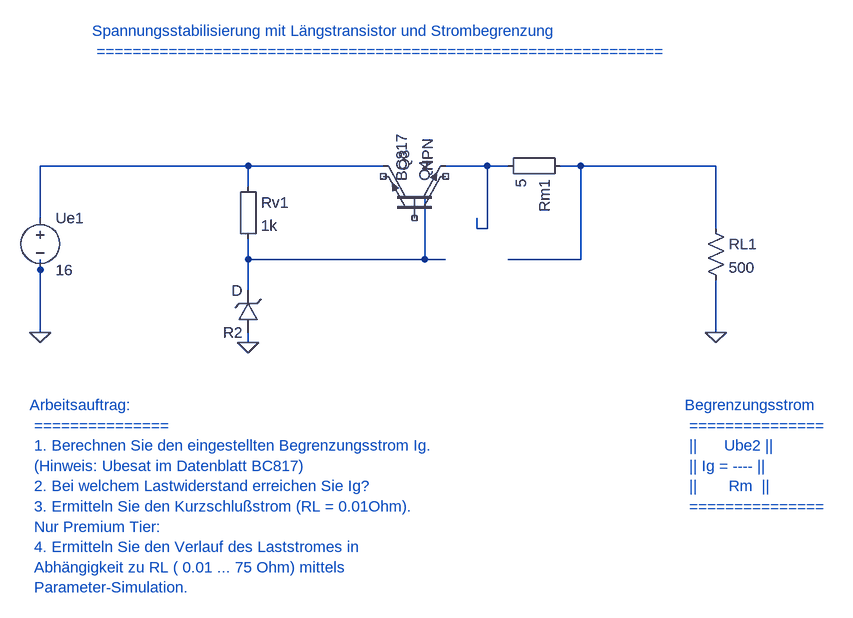
[diagram p0: schematic 5_7_5_Spannungsstabilisierung_mit_Strombegrenzung.asc]
5_7_5_Spannungsstabilisierung_mit_Strombegrenzung.asc, the LTspice schematic file:
Version 4
SHEET 1 880 680
WIRE 160 416 160 400
WIRE 736 320 736 304
WIRE 736 304 752 304
WIRE 784 256 816 256
WIRE 480 448 480 416
WIRE 832 336 832 352
WIRE 832 352 848 352
WIRE 880 400 912 400
WIRE 160 512 160 400
WIRE 1200 512 1200 432
WIRE 480 368 480 400
WIRE 688 256 480 256
WIRE 480 256 480 288
WIRE 160 336 160 256
WIRE 160 256 480 256
WIRE 480 416 480 400
WIRE 480 512 480 528
WIRE 880 256 848 256
WIRE 1200 352 1200 256
WIRE 1200 256 992 256
WIRE 480 400 752 400
WIRE 752 400 752 304
WIRE 784 400 752 400
WIRE 992 256 960 256
WIRE 912 400 992 400
WIRE 992 400 992 256
WIRE 848 256 816 256
WIRE 848 352 848 256
FLAG 160 512 0
FLAG 480 528 0
FLAG 1200 512 0
FLAG 160 512 0
FLAG 480 528 0
FLAG 1200 512 0
SYMBOL voltage 160 320 R0
SYMATTR InstName Ue1
SYMATTR Value 16
SYMBOL Misc\EuropeanResistor 464 272 R0
SYMATTR InstName Rv1
SYMATTR Value 1k
SYMBOL res 1184 336 R0
SYMATTR InstName RL1
SYMATTR Value 500
SYMBOL npn 688 320 R270
SYMATTR InstName Q3
SYMATTR Value NPN
SYMBOL zener 496 512 R180
SYMATTR InstName R2
SYMATTR Value D
SYMBOL Misc\EuropeanResistor 976 240 R90
SYMATTR InstName Rm1
SYMATTR Value 5
SYMBOL npn 784 336 M270
SYMATTR InstName Q4
SYMATTR Value BC817
TEXT 240 48 Left 2 ;Spannungsstabilisierung mit Längstransistor und Strombegrenzung \n ===============================================================
TEXT 1152 624 Left 2 ;Begrenzungsstrom \n =============== \n ||      Ube2 || \n || Ig = ---- || \n ||       Rm  || \n ===============
TEXT 144 624 Left 2 ;Arbeitsauftrag: \n =============== \n 1. Berechnen Sie den eingestellten Begrenzungsstrom Ig. \n (Hinweis: Ubesat im Datenblatt BC817) \n 2. Bei welchem Lastwiderstand erreichen Sie Ig? \n 3. Ermitteln Sie den Kurzschlußstrom (RL = 0.01Ohm). \n Nur Premium Tier: \n 4. Ermitteln Sie den Verlauf des Laststromes in \n Abhängigkeit zu RL ( 0.01 ... 75 Ohm) mittels \n Parameter-Simulation.

The netlist it stands for:
* 5_7_5_Spannungsstabilisierung_mit_Strombegrenzung.asc
V§Ue1 N004 0 16
Rv1 N004 N001 1k
RL1 N003 0 500
Q3 N004 N001 N002 0 NPN
D§R2 0 N001 D
Rm1 N003 N002 5
Q4 NC_01 NC_02 NC_03 0 BC817
.model D D
.lib standard.dio
.model NPN NPN
.model PNP PNP
.lib standard.bjt
* Spannungsstabilisierung mit Längstransistor und Strombegrenzung
*  ===============================================================
* Begrenzungsstrom
*  ===============
*  ||      Ube2 ||
*  || Ig = ---- ||
*  ||       Rm  ||
*  ===============
* Arbeitsauftrag:
*  ===============
*  1. Berechnen Sie den eingestellten Begrenzungsstrom Ig.
*  (Hinweis: Ubesat im Datenblatt BC817)
*  2. Bei welchem Lastwiderstand erreichen Sie Ig?
*  3. Ermitteln Sie den Kurzschlußstrom (RL = 0.01Ohm).
*  Nur Premium Tier:
*  4. Ermitteln Sie den Verlauf des Laststromes in
*  Abhängigkeit zu RL ( 0.01 ... 75 Ohm) mittels
*  Parameter-Simulation.
.backanno
.end